# EAGLE board pc_healthypi_5.3 (EAGLE 9.6.2)
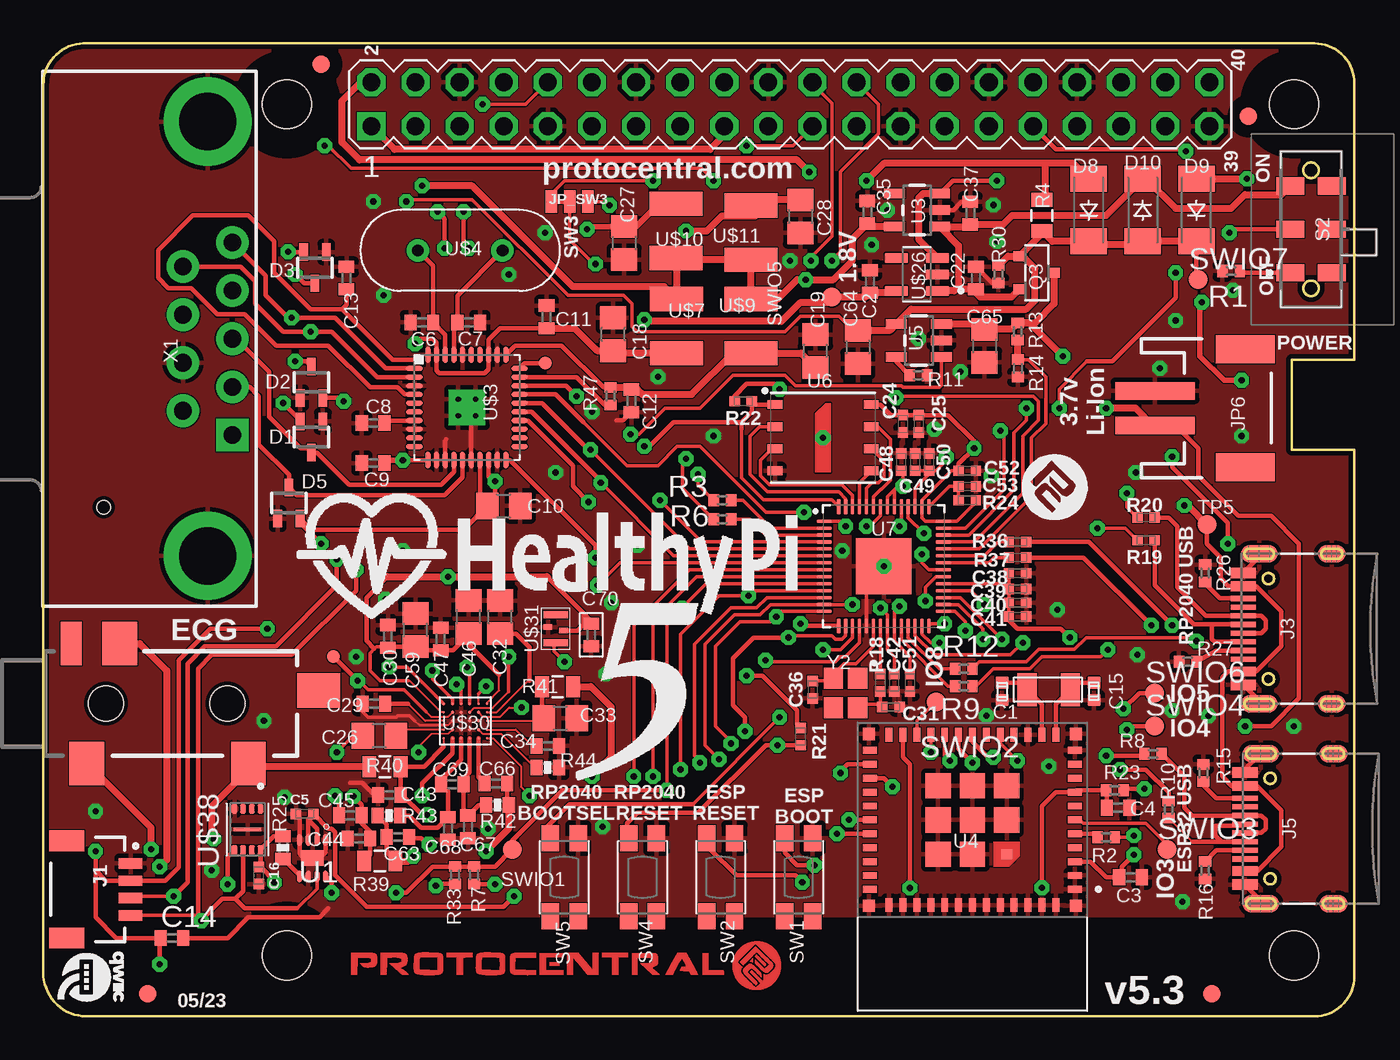
[diagram p3: board, top side]
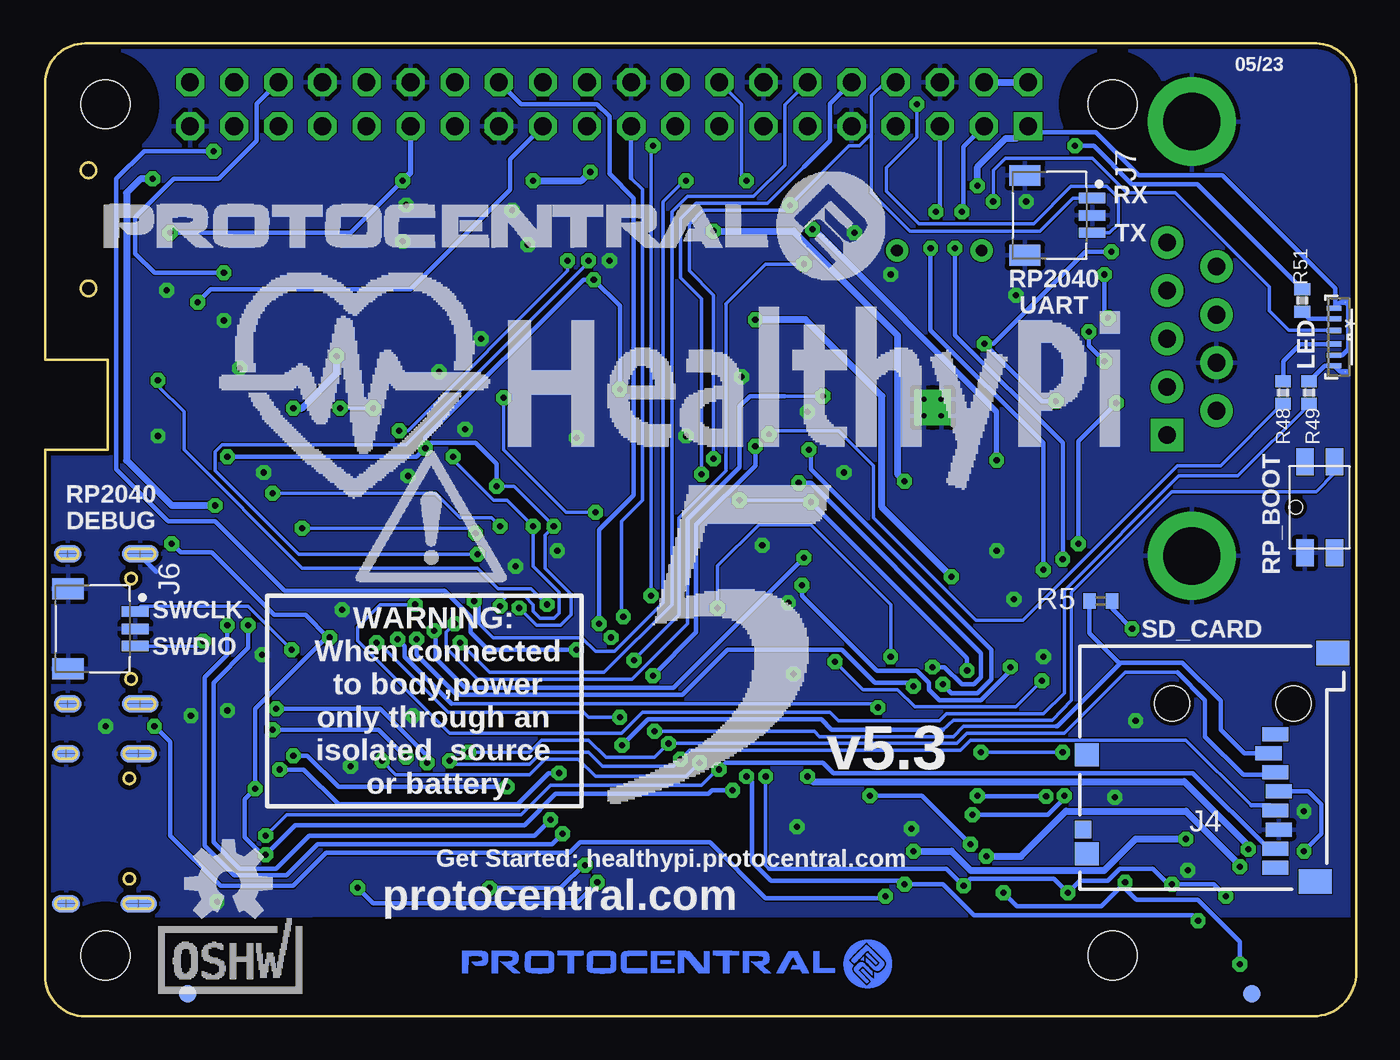
[diagram p4: board, bottom side, seen from below]

Size 75.5 x 56.01 mm. Coordinates in mm from the lower left corner, seen from the top.
Outline: 631 segments
Copper layers (1*16): Top 0.035mm / dielectric 1.5mm / Bottom 0.035mm
Design rules "Circuitects-Rules *": minimum track width 3mil, minimum drill 0.1mm, track to track 0.06858125mm, track to pad 0.06858125mm, pad to pad 0.06858125mm, via to via 6mil, smd to smd 6mil, copper to edge 10mil, drill to drill 4mil, minimum pad ring 12mil, minimum via ring 10mil, stop-mask expansion 4mil, vias tented up to drill 25mil, thermal gap 10mil
Net classes: 1 power: width 0.178 mm; 2 Clock: width 0.089 mm, clearance 0.178 mm; 4 USBpair: width 0.102 mm, drill 0.1 mm, clearance 0.15 mm to class 3
Holes 2.8 mm at 72.02,3.51 72.02,52.51 14.02,52.51 14.02,3.51
Holes 0.9 mm at 73,48.71 73,41.91
Holes 0.65 mm at 70.64,7.92 70.64,13.7 70.55,19.42 70.55,25.2
tRestrict: area 12.5,51 to 15.6,54.1; area 70.5,51 to 73.6,54.1; area 70.5,2 to 73.6,5.1; area 12.5,2 to 15.6,5.1
bRestrict: area 12.5,2 to 15.6,5.1; area 12.5,51 to 15.6,54.1; area 70.5,2 to 73.6,5.1; area 70.5,51 to 73.6,54.1

## Footprints (pad centres in the part's own frame; a part is rotated, then mirrored left to right if it is on the bottom)
C0402 = smd 0.75 x 0.7: 1 0,0.5; 2 0,-0.5
C0402' = smd 0.7 x 0.9: 1 -0.65,0; 2 0.65,0
0402-TIGHT = smd 0.6 x 0.6: 1 -0.5,0; 2 0.5,0
C0805 = smd 1.3 x 1.5: 1 -0.95,0; 2 0.95,0
0402 = smd 0.7 x 0.9: 1 -0.65,0; 2 0.65,0
SOT323 = smd 0.5 x 1: 1 0,0.9; 2 -0.65,-0.9; 3 0.65,-0.9
SOD-123_MINI-SMA = smd 1.5 x 2.1: A 1.8,0; C -1.8,0
JST04_1MM_RA = smd 0.6 x 1.35: 1 -1.5,0; 2 -0.5,0; 3 0.5,0; 4 1.5,0 | smd 1.2 x 2: NC1 2.8,-3.675; NC2 -2.8,-3.675
USB-C-16P = smd 0.3 x 1.45: A5 -1.25,0; A6 -0.25,0; A7 0.25,0; A8 1.25,0; B5 1.75,0; B6 0.75,0; B7 -0.75,0; B8 -1.75,0 | smd 0.6 x 1.45: GND -3.225,0; GND2 3.225,0 | smd 1 x 2.1: SHLD1 -4.32,-0.915; SHLD2 4.32,-0.915 | smd 1 x 2.1 bottom: SHLD3 -4.32,-0.915; SHLD4 4.32,-0.915 | smd 1 x 1.6: SHLD5 -4.32,-5.095; SHLD8 4.32,-5.095 | smd 1 x 1.6 bottom: SHLD6 -4.32,-5.095; SHLD7 4.32,-5.095 | smd 0.55 x 1.45: VBUS1 -2.45,0; VBUS2 2.45,0 | hole 0.65: -2.89,-1.445; 2.89,-1.445
GCT_MEM2051-00-195-00-A = smd 0.8 x 1.5: 1 1.94,-3.66; 2 0.84,-3.26; 3 -0.26,-3.66; 4 -1.36,-3.86; 5 -2.46,-3.66; 6 -3.56,-3.86; 7 -4.66,-3.66; 8 -5.76,-3.66 | smd 1 x 0.95: 9 -3.56,7.425 | smd 1.3 x 1.4: P1 -4.95,7.2; P2 0.75,7.2 | smd 1.4 x 1.9: P3 6.6,-6.95; P4 -6.55,-5.95
JST_SM03B-SRSS-TB(LF)(SN) = smd 0.6 x 1.55: 1 -1,0; 2 0,0; 3 1,0 | smd 1.2 x 1.8: S1 -2.3,-3.875; S2 2.3,-3.875
AUDIO-JACK-3.5MM-SMD = smd 2 x 2.5: RING 4.3,3.45; SLEEVE 2.4,-3.45; TIP 11.7,-3.45 | smd 1.2 x 2.5: RSH 1.5,3.45 | smd 2.5 x 2: TSH 15.75,0.75 | hole 2: 3.5,0; 10.5,0
JST-2-SMD = smd 1 x 4.6: 1 -1,-3.7; 2 1,-3.7 | smd 1.6 x 3.4: NC1 -3.4,1.5; NC2 3.4,1.5
SMT-JUMPER_3_1-NC_TRACE_NO-SILK = smd 0.66 x 1.27: 1 -1.041,0; 2 0,0; 3 1.041,0
PIN_20X2 = drill 1.016 square: 1 -24.13,-1.27 | drill 1.016 octagon: 2 -24.13,1.27; 3 -21.59,-1.27; 4 -21.59,1.27; 5 -19.05,-1.27; 6 -19.05,1.27; 7 -16.51,-1.27; 8 -16.51,1.27; 9 -13.97,-1.27; 10 -13.97,1.27; 11 -11.43,-1.27; 12 -11.43,1.27; 13 -8.89,-1.27; 14 -8.89,1.27; 15 -6.35,-1.27; 16 -6.35,1.27; 17 -3.81,-1.27; 18 -3.81,1.27; 19 -1.27,-1.27; 20 -1.27,1.27; 21 1.27,-1.27; 22 1.27,1.27; 23 3.81,-1.27; 24 3.81,1.27; 25 6.35,-1.27; 26 6.35,1.27; 27 8.89,-1.27; 28 8.89,1.27; 29 11.43,-1.27; 30 11.43,1.27; 31 13.97,-1.27; 32 13.97,1.27; 33 16.51,-1.27; 34 16.51,1.27; 35 19.05,-1.27; 36 19.05,1.27; 37 21.59,-1.27; 38 21.59,1.27; 39 24.13,-1.27; 40 24.13,1.27
LTST-008BGEW_LTO = smd 0.051 x 0.051: 1 2,0.372; 8 -2,0.372 | smd 0.305 x 0.813: 2 1.65,-0.268; 3 1.05,-0.268; 4 0.41,-0.268; 5 -0.38,-0.268; 6 -1.05,-0.268; 7 -1.65,-0.268
SOT23-R = smd 0.6 x 0.7: 1 -0.95,-1; 2 0.95,-1; 3 0,1
R0402 = smd 0.6 x 0.7: 1 -0.5,0; 2 0.5,0
0805 = smd 0.8 x 1.2: 1 -0.9,0; 2 0.9,0
R0402' = smd 0.7 x 0.9: 1 -0.65,0; 2 0.65,0
0402-RES = smd 0.7 x 0.9: 1 -0.65,0; 2 0.65,0
JS202011JAQN = smd 1 x 1.6: 1 -2.5,1.2; 2 0,1.2; 3 2.5,1.2; 4 -2.5,-1.2; 5 0,-1.2; 6 2.5,-1.2 | hole 0.9: -3.4,0; 3.4,0
BTN_KMR2_4.6X2.8 = smd 1.5 x 1: A 2.25,0.8; A' -2.25,0.8; B 2.25,-0.8; B' -2.25,-0.8
TP11R = smd 1.1 x 1.1: TP 0,0
PAD.03X.03 = smd 0.762 x 0.762: P$1 0,0
SON50P200X200X80-9N = smd 0.7 x 0.3: 1 -1.05,0.75; 2 -1.05,0.25; 3 -1.05,-0.25; 4 -1.05,-0.75; 5 1.05,-0.75; 6 1.05,-0.25; 7 1.05,0.25; 8 1.05,0.75 | smd 0.9 x 1.3: 9 0,0
SOT23-5 = smd 0.55 x 1.2: 1 -0.95,-1.3; 2 0,-1.3; 3 0.95,-1.3; 4 0.95,1.3; 5 -0.95,1.3
XCVR_ESP32-C3-MINI-1-N4 = smd 0.8 x 0.4: 1 -5.9,1.3; 2 -5.9,0.5; 3 -5.9,-0.3; 4 -5.9,-1.1; 5 -5.9,-1.9; 6 -5.9,-2.7; 7 -5.9,-3.5; 8 -5.9,-4.3; 9 -5.9,-5.1; 10 -5.9,-5.9; 11 -5.9,-6.7; 25 5.9,-6.7; 26 5.9,-5.9; 27 5.9,-5.1; 28 5.9,-4.3; 29 5.9,-3.5; 30 5.9,-2.7; 31 5.9,-1.9; 32 5.9,-1.1; 33 5.9,-0.3; 34 5.9,0.5; 35 5.9,1.3 | smd 0.4 x 0.8: 12 -4.8,-7.6; 13 -4,-7.6; 14 -3.2,-7.6; 15 -2.4,-7.6; 16 -1.6,-7.6; 17 -0.8,-7.6; 18 0,-7.6; 19 0.8,-7.6; 20 1.6,-7.6; 21 2.4,-7.6; 22 3.2,-7.6; 23 4,-7.6; 24 4.8,-7.6; 36 4.8,2.2; 37 4,2.2; 38 3.2,2.2; 39 2.4,2.2; 40 1.6,2.2; 41 0.8,2.2; 42 0,2.2; 43 -0.8,2.2; 44 -1.6,2.2; 45 -2.4,2.2; 46 -3.2,2.2; 47 -4,2.2; 48 -4.8,2.2 | smd 0.6 x 0.6: 49_1 -1.975,-0.725 | smd 1.45 x 1.45: 49_2 0,-0.725; 49_3 1.975,-0.725; 49_4 1.975,-2.7; 49_5 1.975,-4.675; 49_6 0,-4.675; 49_7 -1.975,-4.675; 49_8 -1.975,-2.7; 49_9 0,-2.7 | smd 0.7 x 0.7: 50 5.95,2.25; 51 5.95,-7.65; 52 -5.95,-7.65; 53 -5.95,2.25
WSON-8-6X5-SKINNY_CENTERPAD = smd 0.85 x 0.5: 1 -2.775,1.905; 2 -2.775,0.635; 3 -2.775,-0.635; 4 -2.775,-1.905; 5 2.775,-1.905; 6 2.775,-0.635; 7 2.775,0.635; 8 2.775,1.905
QFN-56 = smd 0.875 x 0.2: 1 -3.437,2.6; 2 -3.437,2.2; 3 -3.437,1.8; 4 -3.437,1.4; 5 -3.437,1; 6 -3.437,0.6; 7 -3.437,0.2; 8 -3.437,-0.2; 9 -3.437,-0.6; 10 -3.437,-1; 11 -3.437,-1.4; 12 -3.437,-1.8; 13 -3.437,-2.2; 14 -3.437,-2.6; 29 3.437,-2.6; 30 3.437,-2.2; 31 3.437,-1.8; 32 3.437,-1.4; 33 3.437,-1; 34 3.437,-0.6; 35 3.437,-0.2; 36 3.437,0.2; 37 3.437,0.6; 38 3.437,1; 39 3.437,1.4; 40 3.437,1.8; 41 3.437,2.2; 42 3.437,2.6 | smd 0.2 x 0.875: 15 -2.6,-3.437; 16 -2.2,-3.437; 17 -1.8,-3.437; 18 -1.4,-3.437; 19 -1,-3.437; 20 -0.6,-3.437; 21 -0.2,-3.437; 22 0.2,-3.437; 23 0.6,-3.437; 24 1,-3.437; 25 1.4,-3.437; 26 1.8,-3.437; 27 2.2,-3.437; 28 2.6,-3.437; 43 2.6,3.437; 44 2.2,3.437; 45 1.8,3.437; 46 1.4,3.437; 47 1,3.437; 48 0.6,3.437; 49 0.2,3.437; 50 -0.2,3.437; 51 -0.6,3.437; 52 -1,3.437; 53 -1.4,3.437; 54 -1.8,3.437; 55 -2.2,3.437; 56 -2.6,3.437 | smd 3.2 x 3.2: EPAD 0,0
FIDUCIALPOINTS = smd 1 x 1: TP 0,0
QFN-40 = smd 0.95 x 0.28: 1 -3.025,2.25; 2 -3.025,1.75; 3 -3.025,1.25; 4 -3.025,0.75; 5 -3.025,0.25; 6 -3.025,-0.25; 7 -3.025,-0.75; 8 -3.025,-1.25; 9 -3.025,-1.75; 10 -3.025,-2.25; 21 3.025,-2.25; 22 3.025,-1.75; 23 3.025,-1.25; 24 3.025,-0.75; 25 3.025,-0.25; 26 3.025,0.25; 27 3.025,0.75; 28 3.025,1.25; 29 3.025,1.75; 30 3.025,2.25 | smd 0.28 x 0.95: 11 -2.25,-3.025; 12 -1.75,-3.025; 13 -1.25,-3.025; 14 -0.75,-3.025; 15 -0.25,-3.025; 16 0.25,-3.025; 17 0.75,-3.025; 18 1.25,-3.025; 19 1.75,-3.025; 20 2.25,-3.025; 31 2.25,3.025; 32 1.75,3.025; 33 1.25,3.025; 34 0.75,3.025; 35 0.25,3.025; 36 -0.25,3.025; 37 -0.75,3.025; 38 -1.25,3.025; 39 -1.75,3.025; 40 -2.25,3.025 | drill 0.3 pad 1.1 square: EXP@6 -0.5,0.475; EXP@7 0.5,0.475; EXP@10 -0.5,-0.475; EXP@11 0.5,-0.475
XTAL_HC49P488W43L1150T466H350 = drill 0.68 pad 1.08: 1 -2.44,0; 2 2.44,0
LPS = smd 1.4 x 3.05: 1 -1.56,0; 2 1.56,0
ECX-31B = smd 1.1 x 1.9: P$1 1.25,0; P$2 -1.25,0
EVQ-PUC = smd 1.55 x 1: 1 2.625,0.85; 2 2.625,-0.85; 3 -2.625,0.85; 4 -2.625,-0.85 | hole 0.75: 0,1.375
SOT95P285X140-5N = smd 1.35 x 0.6: 1 -1.185,0.95; 2 -1.185,0; 3 -1.185,-0.95; 4 1.185,-0.95; 5 1.185,0.95
30WLP = smd 0.15 x 0.15: A1 -1.25,1; A2 -0.75,1; A3 -0.25,1; A4 0.25,1; A5 0.75,1; A6 1.25,1; B1 -1.25,0.5; B6 1.25,0.5; C1 -1.25,0; C6 1.25,0; D1 -1.25,-0.5; D6 1.25,-0.5; E1 -1.25,-1; E2 -0.75,-1; E3 -0.25,-1; E4 0.25,-1; E5 0.75,-1; E6 1.25,-1 | smd 0.2 x 0.2: B2 -0.75,0.5; B3 -0.25,0.5; B4 0.25,0.5; B5 0.75,0.5; C2 -0.75,0; C3 -0.25,0; C4 0.25,0; C5 0.75,0; D2 -0.75,-0.5; D3 -0.25,-0.5; D4 0.25,-0.5; D5 0.75,-0.5
SIT1533 = smd 0.4 x 1.4: 1 -0.8,0; 3 0.8,0 | smd 0.3 x 0.5: 2 -0.1,-0.45; 4 0.1,0.45
PSON50P200X300X60-9N = smd 0.56 x 0.35: 1 -1.185,0.75; 2 -1.185,0.25; 3 -1.185,-0.25; 4 -1.185,-0.75; 5 1.185,-0.75; 6 1.185,-0.25; 7 1.185,0.25; 8 1.185,0.75 | smd 0.2 x 1.6: 9 0,0
DB9 = drill 1.016 pad 1.88 square: 1 -5.54,-1.42 | drill 1.016 pad 1.88: 2 -2.77,-1.42; 3 0,-1.42; 4 2.77,-1.42; 5 5.54,-1.42; 6 -4.15,1.42; 7 -1.38,1.42; 8 1.38,1.42; 9 4.15,1.42 | drill 3.302 pad 5.08: G1 -12.5,0; G2 12.5,0
CRYSTAL-SMD-2X2.5MM = smd 1.2 x 1.1: P1 0.846,0.69; P2 -0.854,0.69; P3 -0.854,-0.71; P4 0.846,-0.71

## Placement (x,y rotation side)
C1  12pF  [C0402]  55.2,18.71 0 top
C2  100nF  [C0402']  47.6,42.31 90 top
C3  1u  [C0402']  62.6,8.01 180 top
C4  1u  [C0402']  61.9,12.01 180 top
C5  0.1uF  [0402-TIGHT]  15.05,11.66 180 top
C6  22p  [C0402']  21.79,39.95 0 top
C7  22p  [C0402']  24.49,39.95 180 top
C8  2.2u  [C0402']  18.99,34.15 180 top
C9  0.1u  [C0402']  18.99,31.85 180 top
C10  1u  [C0805]  26.51,29.38 0 top
C11  0.1u  [C0402']  28.97,40.27 90 top
C12  0.1u  [C0402']  33.86,35.43 270 top
C13  2.2u  [C0402']  17.46,42.5 90 top
C14  100nF  [C0402']  7.4,4.51 0 top
C15  12pF  [C0402]  60.5,18.71 180 top
C16  0.1uF  [0402-TIGHT]  12.4,8.11 270 top
C18  10uF/0805  [C0805]  32.81,39.27 90 top
C19  10uF/0805  [C0805]  44.46,38.3 90 top
C22  100nF  [C0402']  53.7,42.51 90 top
C24  0.1uF  [0402-TIGHT]  49.5,34.11 270 top
C25  2.2uF  [0402-TIGHT]  50.4,34.11 270 top
C26  10uF/25V  [C0805]  19.34,16.15 180 top
C27  10uF/0805  [C0805]  33.44,44.52 270 top
C28  10uF/0805  [C0805]  43.59,46.05 270 top
C29  1nF  [C0402']  19.03,18 180 top
C30  1uF  [C0402']  19.84,21.88 90 top
C31  15pF  [0402-TIGHT]  48.8,17.81 180 top
C32  10uF  [C0805]  26.31,22.99 90 top
C33  10uF  [C0805]  29.76,17.17 0 top
C34  1uF  [C0402']  29.05,15.57 0 top
C35  1u  [C0402']  47.45,46.29 270 top
C36  15pF  [0402-TIGHT]  44.3,18.81 90 top
C37  1u  [C0402']  53.38,46.24 270 top
C38  0.1uF  [0402-TIGHT]  56.1,25.51 0 top
C39  0.1uF  [0402-TIGHT]  56.1,24.61 0 top
C40  0.1uF  [0402-TIGHT]  56.1,23.81 0 top
C41  0.1uF  [0402-TIGHT]  56.1,23.01 0 top
C42  0.1uF  [0402-TIGHT]  49,19.21 270 top
C43  10pF  [C0402']  19.92,12.74 180 top
C44  10pF  [C0402']  18.17,10.24 180 top
C45  DNP  [C0402']  17.68,11.58 180 top
C46  10uF  [C0805]  24.48,23 90 top
C47  1uF  [C0402']  22.88,21.72 90 top
C48  0.1uF  [0402-TIGHT]  49.4,31.91 90 top
C49  0.1uF  [0402-TIGHT]  50.2,31.91 90 top
C50  0.1uF  [0402-TIGHT]  51,31.91 90 top
C51  2.2uF  [0402-TIGHT]  49.9,19.21 270 top
C52  2.2uF  [0402-TIGHT]  53.2,31.41 0 top
C53  2.2uF  [0402-TIGHT]  53.2,30.51 0 top
C59  10uF  [C0805]  21.43,22.24 90 top
C63  47nF  [C0402']  20.41,10.33 0 top
C64  4.7u  [C0805]  46.9,38.52 270 top
C65  4.7u  [C0805]  54.2,38.59 270 top
C66  47nF  [C0402']  26.05,13.41 180 top
C67  DNP  [C0402']  24.45,10.91 270 top
C68  DNP  [C0402']  23.3,10.81 270 top
C69  DNP  [C0402']  23.55,13.36 180 top
C70  1uF  [0402]  31.55,21.96 270 top
D1  BAV99W-7-F  [SOT323]  15.44,33.35 180 top
D2  BAV99W-7-F  [SOT323]  15.44,36.5 0 top
D3  BAV99W-7-F  [SOT323]  15.64,43.1 180 top
D5  BAV99W-7-F  [SOT323]  14.14,29.55 0 top
D8  DNP  [SOD-123_MINI-SMA]  60.2,46.41 90 top
D9  S1B-13-F  [SOD-123_MINI-SMA]  66.4,46.41 90 top
D10  S1B-13-F  [SOD-123_MINI-SMA]  63.3,46.41 270 top
J1  10147606-00004LF  [JST04_1MM_RA]  5.02,7.31 270 top
J3  USB4105-GF-A  [USB-C-16P]  69.1,22.31 90 top
J4  MEM2051-00-195-00-A  [GCT_MEM2051-00-195-00-A]  8.3,14.31 90 bottom
J5  USB4105-GF-A  [USB-C-16P]  69.2,10.81 90 top
J6  SM03B-SRSS-TB(LF)(SN)  [JST_SM03B-SRSS-TB(LF)(SN)]  70.3,22.31 270 bottom
J7  SM03B-SRSS-TB(LF)(SN)  [JST_SM03B-SRSS-TB(LF)(SN)]  15.2,46.11 270 bottom
JP3  35RASMT4BHNTRX  [AUDIO-JACK-3.5MM-SMD]  0.1,18.01 0 top
JP6  S2B-PH-SM4-TB(LF) (SN)  [JST-2-SMD]  67.72,35.01 270 top
JP_SW3  JUMPER-SMT_3_1-NC_TRACE_NO-SILK  [SMT-JUMPER_3_1-NC_TRACE_NO-SILK]  30.3,46.91 180 top
K1  PIN20X2 (2223)  [PIN_20X2]  43.02,52.51 0 top
LED1  LTST-006GEBW-P2  [LTST-008BGEW_LTO]  1,39.11 270 bottom
Q3  SI2323DS-TI-GE3  [SOT23-R]  57.2,42.81 270 top
R1  DNP  [R0402]  68.4,42.91 0 top
R2  0R  [R0402]  61.2,10.31 180 top
R3  100R  [R0402]  39.1,29.71 180 top
R4  0R  [0805]  57.5,46.11 270 top
R5  10K  [R0402']  14.7,23.91 0 bottom
R6  100R  [R0402]  39.1,28.61 180 top
R7  10K  [R0402]  24.8,8.12 270 top
R8  22R  [R0402]  63.9,15.11 180 top
R9  100R  [R0402]  53,19.01 180 top
R10  22R  [R0402]  64.8,11.91 90 top
R11  1k  [R0402]  50.38,36.91 180 top
R12  100R  [R0402]  53,20.01 180 top
R13  10K  [R0402]  56.1,39.42 90 top
R14  10K  [R0402]  56.12,37.31 90 top
R15  5.1K  [R0402]  66.8,14.01 90 top
R16  5.1K  [R0402]  66.9,8.41 270 top
R18  1k  [0402-TIGHT]  48.2,19.21 90 top
R19  27  [0402-TIGHT]  63.5,27.41 180 top
R20  27  [0402-TIGHT]  63.5,28.71 180 top
R21  1k  [0402-TIGHT]  43.6,16.11 270 top
R22  10k  [0402-TIGHT]  40.3,35.41 180 top
R23  0R  [R0402]  61.7,13.01 0 top
R24  200OHM-0402T-1/16W-1%  [0402-TIGHT]  53.2,29.71 0 top
R25  10K  [0402-RES]  13.8,9.71 90 top
R26  5.1K  [R0402]  66.9,25.51 90 top
R27  5.1K  [R0402]  65.9,20.41 180 top
R30  10K  [R0402]  55,42.71 90 top
R33  10K  [R0402]  23.7,8.12 270 top
R36  DNP  [0402-TIGHT]  56.1,27.31 0 top
R37  DNP  [0402-TIGHT]  56.1,26.41 0 top
R39  200K  [0805]  19.37,8.94 180 top
R40  200K  [0805]  19.67,14.38 0 top
R41  0R  [0805]  29.61,18.98 0 top
R42  0R  [0402-RES]  26.15,12.16 180 top
R43  0R  [0402-RES]  19.9,11.56 0 top
R44  DNP  [0402-RES]  29.04,14.33 0 top
R47  10K  [R0402]  32.66,35.7 270 top
R48  330R  [0402-RES]  4.2,35.91 90 bottom
R49  330R  [0402-RES]  2.7,35.91 90 bottom
R51  330R  [0402-RES]  3.1,41.21 90 bottom
S2  JS202011JAQN  [JS202011JAQN]  73,45.31 90 top
SW1  KMR211GLFS  [BTN_KMR2_4.6X2.8]  43.5,8.01 270 top
SW2  KMR211GLFS  [BTN_KMR2_4.6X2.8]  39,8.01 270 top
SW4  KMR211GLFS  [BTN_KMR2_4.6X2.8]  34.5,8.01 270 top
SW5  KMR211GLFS  [BTN_KMR2_4.6X2.8]  30,8.01 270 top
SWIO1  TPSQTP11R  [TP11R]  27,9.61 0 top
SWIO2  TPSQTP11R  [TP11R]  51.4,18.11 0 top
SWIO3  TPSQTP11R  [TP11R]  64.7,9.61 0 top
SWIO4  TPSQTP11R  [TP11R]  64,16.71 0 top
SWIO5  TPSQTP11R  [TP11R]  45.4,41.41 180 top
SWIO6  TPSQTP11R  [TP11R]  64,18.61 0 top
SWIO7  TPSQTP11R  [TP11R]  66.5,42.41 0 top
TP2  TEST-POINT3  [PAD.03X.03]  16.7,20.71 0 top
TP4  TEST-POINT3  [PAD.03X.03]  28.89,37.6 0 top
TP5  TPSQTP11R  [TP11R]  67,28.31 0 top
U1  MAX17048G+TDFN-08  [SON50P200X200X80-9N]  15.5,9.11 270 top
U3  TCR2EF33,LM(CT  [SOT23-5]  50.32,46.41 90 top
U4  ESP32-C3-MINI-1-N4  [XCVR_ESP32-C3-MINI-1-N4]  53.5,8.61 180 top
U5  MCP73831T-2ATI/OT  [SOT23-5]  50.42,38.91 90 top
U6  W25Q128JVPIQ  [WSON-8-6X5-SKINNY_CENTERPAD]  44.9,33.31 0 top
U7  RP2040TR13  [QFN-56]  48.4,25.91 0 top
U$1  FUDCIALPOINTS  [FIDUCIALPOINTS]  16,54.81 0 top
U$2  [HEALTHYPI_5_ONLY]  30.7,13.61 0 top
U$3  AFE4400RHAR  [QFN-40]  24.39,35.05 0 top
U$4  HC-49/U-S16000000ABJB  [XTAL_HC49P488W43L1150T466H350]  24,44.09 180 top
U$5  OSHW-LOGOM  [OSHW-LOGO-M]  64.94,7.64 0 bottom
U$7  MAKK2520H100M  [LPS]  36.46,39.73 270 top
U$9  MAKK2520H100M  [LPS]  40.76,39.73 270 top
U$10  MAKK2520H100M  [LPS]  36.44,45.21 90 top
U$11  MAKK2520H100M  [LPS]  40.74,45.11 90 top
U$13  [CERT-SMALL-SILK]  64.84,1.31 0 bottom
U$17  [WARNINGSYM]  57.7,24.91 0 bottom
U$18  [HEALTHYPIFIT]  14.6,18.21 0 top
U$19  520-327-12.5-34B(32.768KHZ)  [ECX-31B]  57.9,18.81 180 top
U$20  [HEALTHYPIV5LOGO]  65.4,12.31 0 bottom
U$21  FUDCIALPOINTS  [FIDUCIALPOINTS]  67.3,1.31 0 top
U$22  [PC_LOGO_ONELINE_ROUND]  17.6,1.41 0 top
U$23  FUDCIALPOINTS  [FIDUCIALPOINTS]  6,1.31 0 top
U$24  EVQ-PUC  [EVQ-PUC]  2.1,29.31 90 bottom
U$25  FUDCIALPOINTS  [FIDUCIALPOINTS]  67.3,1.31 0 bottom
U$26  TCR2EF18,LM(CT  [SOT95P285X140-5N]  50.3,42.71 180 top
U$27  [PC_LOGO_ONELINE_ROUND]  51.6,1.51 0 bottom
U$28  FUDCIALPOINTS  [FIDUCIALPOINTS]  69.4,51.81 0 top
U$29  FUDCIALPOINTS  [FIDUCIALPOINTS]  6,1.31 0 bottom
U$30  MAX30001CWV+  [30WLP]  24.3,17.01 180 top
U$31  SIT1533AI-H4-DCC-32.768E  [SIT1533]  29.5,22.31 270 top
U$35  [PCROUNDLOGO]  52.7,26.41 0 top
U$36  [PCLOGOV3]  72.1,42.41 0 bottom
U$38  ATECC608A-MAHDA-T  [PSON50P200X300X60-9N]  11.75,10.76 270 top
U$59  [QWIIC#LABEL#FULL#M#PNG]  2.73,2.34 270 top
X1  A-DF09A/KG-T2S  [DB9]  9.46,39.01 90 top
Y2  NX3225SA-12MHZ-STD-CSR-3  [CRYSTAL-SMD-2X2.5MM]  46.2,18.61 270 top

## Tracks (layer width: path | path; a pad name or v marks a point on that pad's centre or on a via)
1.1V  (via drill 0.35)
  Top 0.2: U7.45 50.2,30.41 51,31.21 C50.1 | C49.1 C50.1 | C51.1 49.9,20.71 49,21.61 U7.23 49,23.31 v49.3,23.61 | v47.4,28.21 47.6,28.21 48.2,28.81 U7.50 | C50.1 51.4,31.41 52,32.01 v52,32.21
  Bottom 0.2: v49.3,23.61 49.3,23.81 48.9,24.21 47.9,24.21 47.4,23.71 47.4,23.31 47,22.91 46.2,22.91 45.9,23.21 45.9,24.41 47.4,25.91 v47.4,28.21 48.9,29.71 49.66,29.71 52,32.04 v52,32.21
!ADC_RESET
  Top 0.254: R47.2 32.31,35.2 30.71,36.8 U$3.29
!RESET!  (via drill 0.35)
  Top 0.2: U7.26 50.2,21.91 51.3,20.81 55.7,20.81 v56.4,21.51 | v42.4,17.21 37.4,12.21
  Top 0.254: 37.4,12.21 30.3,12.21 29,10.91 SW5.B'
  Bottom 0.2: v56.4,21.51 56.3,21.51 52.3,17.51 44.5,17.51 44.2,17.21 v42.4,17.21
+1.8V  (via drill 0.35)
  Top 0.127: U$30.D6 22.9,17.51 21.1,19.31 21,19.31 | U$30.E1 25.55,18.06 26.25,18.76 26.25,19.66
  Top 0.2: 19.9,21.29 19.18,21.29 19.05,21.16 18.8,20.91 18.8,19.91 19.4,19.31 21,19.31
  Top 0.254: C30.1 19.9,21.29 C59.1 21.65,21.07 C47.1 23.6,21.07 24.48,21.95 C46.1 24.48,21.43 26.25,19.66 | U$31.4 30.75,22.21 31.1,22.56 31.1,23.21 | C70.1 31.55,22.76 31.1,23.21 | 19.8,25.31 18.6,24.11 18.6,21.61 19.05,21.16 | 31.1,23.21 29.05,25.26
  Top 0.406: 19.8,25.31 v23.3,25.31 29,25.31 29.05,25.26 | U$26.5 49.02,41.66 C2.1 47.35,41.41 SWIO5.TP 45.1,41.11 43.6,41.11 42.5,40.01 34.7,40.01 v34.6,40.11
  Bottom 0.406: v23.3,25.31 27.3,29.31 27.3,35.71 31.7,40.11 v34.6,40.11
+3V3  (via drill 0.35, 0.35 pad 0.55)
  Top 0.127: U$30.D3 24.8,17.76 25.88,17.76 26.8,18.68
  Top 0.2: 26.8,18.68 v26.8,20.71 | C38.1 C39.1 | C41.1 C40.1 C39.1 | R24.2 53.7,29.61 52.6,28.51 U7.42 50.8,28.51 50.6,28.71 U7.44 50.6,29.71 52.3,31.41 C52.1 | U7.49 48.6,29.91 49,30.31 | C42.1 49,20.71 48.6,21.11 U7.22 48.6,23.11 v48.2,23.51 | U7.10 38.16,24.91 36.78,23.53 v36.78,23.51 35.9,22.63 v35.9,13.01 | v46.2,28.21 45.9,28.51 U7.1 | C48.1 49.5,31.31 v49.5,30.51 49.2,30.51 49,30.31 | U7.48 49,30.31 | C39.1 55.3,24.91 U7.33
  Top 0.254: U4.3 60.3,8.91 61.2,8.01 C3.2 | 61.95,8.16 C3.2 | R23.2 62.3,13.11 v63.4,13.11 | v59.1,21.81 58.6,22.31 56.1,22.31 55.6,22.81 C41.1 | U6.8 48.2,35.21 48.8,34.61 C24.1 C25.1 52.1,34.61 53.6,33.11 v53.6,32.71 52.7,31.81 C52.1 | v35.9,13.01 29.9,13.01 27,10.11 SWIO1.TP 26.02,8.62 R7.1 R33.1 22.42,8.62 20.9,7.11 v20.3,7.11 | R22.2 39.8,35.71 40.5,36.41 42.1,36.41 v42.4,36.11 | C3.2 61.95,8.11 62.1,8.26 62.1,8.61 v62.8,9.31 | v68.2,27.21 68.2,28.41 65,31.61 v65,32.21 | 3,8.41 3,5.71 4.2,4.51 C14.1 6.7,4.46 v6.7,3.01 | 3,8.41 v3,9.51 | v12.9,22.31 9.6,22.31 7.8,20.51 7.8,8.59 7.02,7.81 J1.2 3.6,7.81 3,8.41 | R25.2 13.25,10.36 12.5,9.61 U$38.8 12.5,8.71 C16.1 12.5,8.61 13.3,7.81 v13.3,7.71
  Top 0.406: U3.5 47.63,45.46 C35.2 46.55,44.74 46.55,43.46 45.5,42.41 v43.9,42.41 43.4,42.41 42.29,41.29 U$9.1 40.74,41.31 U$11.1 36.54,43.55 U$10.1 36.46,43.63 U$7.1 35.75,42.01 30.5,42.01 24.7,47.81 v21.8,47.81 | K1.17 39.21,50.71 38.4,49.91 20.22,49.91 K1.1
  Bottom 0.2: v36.78,23.51 36.78,25.93 34.4,28.31 31.4,28.31 26.8,23.71 v26.8,20.71 | v48.2,23.51 47.2,22.51 45.8,22.51 45.2,23.11 45.2,24.31 46.7,25.81 46.7,27.71 v46.2,28.21 48.5,30.51 v49.5,30.51
  Bottom 0.254: v59.1,21.81 59.2,21.81 | 59.2,21.81 59.3,21.81 63.4,17.71 v63.4,13.11 64,12.51 64,10.31 63,9.31 v62.8,9.31 61.1,11.01 47.9,11.01 46.1,12.81 37.3,12.81 37.1,13.01 v35.9,13.01 | v68.2,27.21 67.7,26.71 65.9,26.71 62.3,23.11 60.5,23.11 59.2,21.81 | v53.6,32.71 53.3,33.01 50.7,33.01 49.5,31.81 v49.5,30.51 | v53.6,32.71 53.6,33.31 44.5,42.41 v43.9,42.41 42.4,40.91 v42.4,36.11 | v65,32.21 54.1,32.21 v53.6,32.71 | 1.21,40.82 0.92,41.11 LED1.8 0.46,40.94 0.46,38.41 0.81,38.06 LED1.3 | 1.21,40.82 LED1.7 | 1.21,40.82 1.21,41.92 7.7,48.41 12.5,48.41 15,50.91 18.56,50.91 K1.1 | J4.4 2.74,12.95 2,12.21 2,10.51 v3,9.51 | R5.2 14.05,23.46 v12.9,22.31 | v6.7,3.01 6.7,4.31 9.1,6.71 12.65,6.71 13.3,7.35 v13.3,7.71 14.67,6.33 19.53,6.33 v20.3,7.11
  Bottom 0.406: v21.8,47.81 21.8,48.91 20.17,50.54 19.59,50.54 K1.1
+5V  (via drill 0.35)
  Top 0.406: D8.A 59.3,49.11 57.7,49.11 | 57.7,49.11 48.4,49.11 v47.4,48.11 | v44.1,48.61 43.4,49.31 18.2,49.31 17.2,50.31 17.2,52.71 18.27,53.78 K1.2 | 57.7,49.11 57.7,47.21 R4.1
  Bottom 0.406: K1.4 K1.2 | v47.4,48.11 44.6,48.11 v44.1,48.61
ALRT
  Top 0.254: U1.5 14.75,8.11 R25.1
AVDD
  Top 0.2: U7.43 52.16,30.51 C53.1 R24.1
BAT_MON
  Top 0.2: R14.2 56.72,37.81 57.72,36.81 57.72,34.12 56.9,33.31 56.9,29.91 53.9,26.91 U7.38
  Top 0.406: R13.1 56.1,37.82 R14.2
BOOT  (via drill 0.35)
  Top 0.254: R21.2 v42.28,15.61 41.6,15.61 37.7,11.71 34.2,11.71 33.6,11.11 SW4.B'
  Bottom 0.2: 23.8,16.51 23.2,17.06 17.5,17.06 16.4,18.21 16.4,24.41 10.6,30.21 2.3,30.21 1.25,31.26 U$24.2
  Bottom 0.254: v42.28,15.61 40.77,17.12 38.51,17.12 38.5,17.11 30.8,17.11 30.2,16.51 23.8,16.51
CHR_STUS  (via drill 0.35)
  Top 0.2: U5.1 51.72,36.32 51.6,36.21 49.5,36.21 49.4,36.31 43.3,36.31 42.7,36.91 39.7,36.91 37.8,35.01 35.8,35.01 34.3,33.51 v33.8,33.51
  Bottom 0.2: v33.8,33.51 33.7,33.51 33.5,33.71 29.8,33.71 27.8,31.71 27.8,28.71 21.9,22.81 19.2,22.81 10.3,31.71 7.8,31.71 4.25,35.26 R48.1
ECG_CS  (via drill 0.35)
  Top 0.2: U$30.E6 20.95,20.11 v19.9,20.11 | U7.7 33.2,26.11 v31.9,24.81
  Bottom 0.254: v19.9,20.11 19.9,19.91 21.6,18.21 24,18.21 24.6,18.81 24.6,19.21 25.3,19.91 27.6,19.91 31.9,24.21 v31.9,24.81
ECG_VCM
  Top 0.127: U$30.C1 28.65,17.01
  Top 0.254: 28.65,17.01 C33.1 28.71,17.27 R41.1
ECGN  (via drill 0.35)
  Top 0.127: U$30.A6 23.05,15.51
  Top 0.254: 23.05,15.51 21.92,14.38 R40.2 C43.1 20.67,12.74 21.8,11.61 v22.1,11.61 | v16.8,12.71 17.03,12.48 C45.2
  Bottom 0.254: v22.1,11.61 17.75,11.61 16.8,12.56 v16.8,12.71
ECGN1  (via drill 0.35)
  Top 0.254: R42.1 26.7,12.26 C66.1
  Top 0.406: R40.1 12.43,14.38 JP3.TIP 11.8,14.21 9.7,12.11 9.7,10.31 v9.8,10.21 | R42.1 26.8,10.81 v25.5,9.51
  Bottom 0.406: v25.5,9.51 23.3,9.51 22.2,8.41 14.5,8.41 12.7,10.21 v9.8,10.21
ECGP  (via drill 0.35)
  Top 0.254: U$30.A5 23.55,15.16 21.8,13.41 v21.8,12.71 | v17.85,12.66 18.33,12.18 C45.1 18.33,11.13 18.82,10.64 C44.1 18.82,9.29 R39.2
  Bottom 0.254: v21.8,12.71 21.75,12.66 v17.85,12.66
ECGP1  (via drill 0.35)
  Top 0.254: R39.1 19.76,9.45 C63.1 19.76,11.05 R43.1
  Top 0.406: R39.1 21.03,8.94 v21.3,9.21 | v6.7,8.61 7.1,9.01 7.1,19.91 5.55,21.46 JP3.RING
  Bottom 0.406: v21.3,9.21 19.3,9.21 16.7,11.81 9.8,11.81 6.7,8.71 v6.7,8.61
EN  (via drill 0.35)
  Top 0.254: U3.3 52.37,48.11 v54.9,48.11 | v68.3,45.11 68.5,45.31 S2.2
  Top 0.406: U3.3 50.65,47.36 50.4,47.11 50.4,44.74 U$26.3
  Bottom 0.254: v68.3,45.11 57.9,45.11 v54.9,48.11
  Bottom 0.305: K1.29 54.45,48.56 v54.9,48.11
ESP32_CS  (via drill 0.35)
  Top 0.2: U7.12 41.66,24.11 41.06,23.51 39.6,23.51 37.5,21.41 37.5,15.01 37.8,14.71 v37.8,14.61 | v56.1,14.71 55.1,15.71 U4.16
  Bottom 0.2: v37.8,14.61 38.6,13.81 43.8,13.81 44.8,14.81 46.7,14.81 47.6,13.91 55.3,13.91 v56.1,14.71
ESP32_MISO
  Top 0.254: U4.5 60.5,10.51 R2.2
ESP32_SD_TFT_MISO  (via drill 0.35)
  Top 0.2: v40.5,50.11 43.16,50.11 K1.21 | U7.11 40.9,24.51 v40.6,24.21 38.9,24.21 36.7,22.01 v36.7,14.21 | v62.8,10.41 62.7,10.31 R2.1
  Bottom 0.2: v40.5,50.11 40.6,50.01 v40.6,24.21 | v62.8,10.41 61.6,11.61 48.1,11.61 46.4,13.31 37.7,13.31 36.8,14.21 v36.7,14.21 36.4,14.51
  Bottom 0.254: J4.7 5.04,9.65 9.4,14.01 30.1,14.01 30.7,14.61 36.3,14.61 36.4,14.51
ESP32_SD_TFT_MOSI  (via drill 0.35)
  Top 0.2: v42.2,23.01 42.5,23.31 U7.14 42.46,23.31 41.86,22.71 40.1,22.71 38.7,21.31 38.7,16.71 39.6,15.81 v39.6,15.71 | U4.21 v51.1,15.21
  Bottom 0.2: v42.2,23.01 42.3,23.11 42.3,28.51 41.1,29.71 41.1,47.61 41.75,48.26 | v51.1,15.21 47.6,15.21 46.9,15.91 44.2,15.91 43.2,14.91 40.4,14.91 v39.6,15.71 23,15.71 22.4,16.31 16.8,16.31 13.3,19.81 10.3,19.81
  Bottom 0.254: 41.75,48.26 K1.19 | J4.3 4.78,13.91 6.5,13.91 8.7,16.11 8.7,18.21 10.3,19.81
ESP32_SD_TFT_SCK  (via drill 0.35)
  Top 0.2: v52.2,14.71 51.9,15.01 U4.20 | v38.9,14.81 38.1,15.61 38.1,21.41 39.8,23.11 41.26,23.11 41.86,23.71 U7.13 v46.6,23.71
  Top 0.305: v69,36.61 68,36.61 66.6,38.01 66.6,41.01 v66.7,41.11
  Bottom 0.2: v69,36.61 69,36.31 67.5,34.81 67.5,32.61 60.7,25.81 50.6,25.81 49.4,24.61 47.5,24.61 v46.6,23.71 | v52.2,14.71 52,14.51 47.6,14.51 46.9,15.21 44.2,15.21 43.4,14.41 39.3,14.41 v38.9,14.81 38.4,15.31 22.8,15.31 22.2,15.91 9.8,15.91 6.03,12.14
  Bottom 0.254: K1.23 48.73,49.34 48.73,47.58 54.45,41.86 65.95,41.86 v66.7,41.11 | J4.5 4.93,12.14 6.03,12.14
ESP32_UART_RXD  (via drill 0.35)
  Top 0.254: R37.2 59.9,26.41 v63.8,22.51 | U4.30 v46.4,11.31
  Bottom 0.254: v63.8,22.51 63.8,21.21 65.8,19.21 65.8,10.01 64.3,8.51 62.2,8.51 60.3,10.41 47.3,10.41 v46.4,11.31
ESP32_UART_TXD  (via drill 0.35)
  Top 0.254: R36.2 60.2,27.31 v65,22.51 | U4.31 v45.7,10.51
  Bottom 0.254: v65,22.51 65,20.81 66.3,19.51 66.3,9.81 64.6,8.11 61.6,8.11 59.8,9.91 46.3,9.91 v45.7,10.51
ESP_BOOT  (via drill 0.35)
  Top 0.254: U4.23 49.5,14.91 49.9,14.51 v49.9,7.39 | v44.4,8.71 43.4,8.71 42.7,9.41 SW1.B'
  Bottom 0.254: v49.9,7.39 45.8,7.39 44.44,8.75 v44.4,8.71
ESP_RST  (via drill 0.35)
  Top 0.254: C4.2 61.25,12.96 R23.1 59.5,13.01 U4.8 58.3,12.91 57.5,12.11 v57.5,7.4 | v43.7,7.71 43.3,8.11 39.9,8.11 38.4,9.61 SW2.B'
  Bottom 0.254: v57.5,7.4 56.61,6.51 44.9,6.51 v43.7,7.71
FCLK  (via drill 0.35)
  Top 0.127: 22.04,17.54 22.32,17.26 23.3,17.26 U$30.D5
  Top 0.2: 22.04,17.54 20.77,18.81 18.7,18.81 18.2,19.31 v18.1,19.31 | v30,20.41 29.4,21.01 29.4,21.41 U$31.3
  Top 0.254: v18.1,19.31 TP2.P$1
  Bottom 0.2: v18.1,19.31 19.6,17.81 25.4,17.81 26.4,18.81 28.4,18.81 v30,20.41
GND  (via drill 0.35, 0.35 pad 0.55, 0.35 pad 0.65)
  Top 0.127: U$30.C5 23.3,16.76 21.65,16.76 21.38,17.03
  Top 0.2: 21.38,17.03 21.1,17.31 20.4,17.31 20.3,17.21 18.7,17.21 18.38,17.53 C29.2 | U7.19 47.4,24.91 U7.EPAD
  Top 0.254: U$3.16 24.64,34.33 U$3.EXP@11 | U$3.13 23.14,33.15 23.2,33.21 | J3.GND 70.02,18.17 J3.SHLD3 | J5.GND 70.11,6.67 J5.SHLD1 | J5.GND2 69.2,14.21 J5.SHLD2 | U3.2 52.4,46.41 52.88,46.89 C37.1 | C22.2 54.65,42.21 R30.1 | J3.GND2 70.02,26.45 J3.SHLD2 | C12.2 33.38,34.31 33,34.31 | C43.2 19.07,12.74 18.35,13.46 17.65,13.46 | 16.4,6.21 15.9,5.71 11.8,5.71 10.6,4.51 C14.2 | C5.2 14.75,11.46 U1.4 14.75,9.36 15,9.11 U1.9 15.9,9.11 16.25,9.46 U1.1
  Bottom 0.254: J3.SHLD2 70.02,26.52 69.1,25.61
  other vias: 9.7,8.41 13.9,12.61 19.7,24.01 32.7,23.81 69,33.41 20.7,26.81 19.6,41.51 32.2,10.91 54.9,44.61 47.7,44.41 51.3,33.81 48.4,25.91 50.4,39.01 44.9,33.31 54.7,46.71 34.2,27.11 29.5,31.31 52.8,37.11 54.6,31.11 46,26.81 62.9,31.31 38.6,33.41 64.3,37.31 43,43.51 25.6,10.81 65,17.61 67.1,17.31 72,16.71 65.2,40.06 65.6,6.61 63,20.81 68.5,41.81 35.4,36.81 31.6,34.81 57.9,14.41 12.7,17.01 32.4,19.71 18,20.71 19,46.91 3,11.81 28.9,45.11 26.8,42.71 54.3,17.31 58.4,23.41 48.6,46.41
  pour Bottom: 0,5.81 75.22,5.81 arc90 75.52,6.11 75.52,54.01 arc90 73.52,56.01 2.17,56.01 arc90 0,53.33
  pour Top: 0,5.81 75.22,5.81 arc90 75.52,6.11 75.52,53.71 arc90 73.22,56.01 2.43,56.01 arc90 0,53.51
INN  (via drill 0.35)
  Top 0.254: v14.5,42.71 15.01,42.2 D3.1 | U$3.1 19.71,37.3 16.8,40.21 v14.3,40.21 14.1,40.21 12.8,41.51 12.8,42.63 X1.5
  Bottom 0.254: v14.5,42.71 14.5,40.41 v14.3,40.21
INP  (via drill 0.35)
  Top 0.254: D2.1 15.13,37.71 v14.5,37.71 | U$3.2 19.21,36.8 16.6,39.41 v15.4,39.41 13.8,39.41 12.2,41.01 12.2,42.31 11.35,43.16 X1.9
  Bottom 0.254: v14.5,37.71 15.4,38.61 v15.4,39.41
INT2B  (via drill 0.35)
  Top 0.127: U$30.E2 25.05,18.56
  Top 0.2: 25.05,18.56 v25.5,19.01 | U7.30 52.7,23.71 54.1,22.31 v54.1,21.71
  Bottom 0.254: v25.5,19.01 25.7,19.21 27.7,19.21 29.61,21.12 36.19,21.12 38.8,18.51 51.8,18.51 54.1,20.81 v54.1,21.71
INTB  (via drill 0.35)
  Top 0.127: U$30.D2 25.3,17.26 26.3,17.26 26.82,17.78 v27.54,17.78
  Top 0.2: U7.31 52.8,24.11 v55.2,21.71
  Bottom 0.2: 52.1,18.01 27.77,18.01 v27.54,17.78
  Bottom 0.254: v55.2,21.71 54.8,21.31 54.8,20.71 52.1,18.01
LED1  (via drill 0.35)
  Top 0.2: v50.8,23.91 50.8,24.71 51.4,25.31 U7.34 | v38.6,48.11 37.9,48.81 17.71,48.81 16.4,50.12 v16.2,50.12
  Bottom 0.2: v50.8,23.91 50.5,23.61 50.5,22.61 49.7,21.81 44.6,21.81 43.8,21.01 42.7,21.01 39.9,23.81 39.9,46.91 38.8,48.01 38.6,48.01 v38.6,48.11
  Bottom 0.254: R51.2 9.15,47.91 12.9,47.91 15.12,50.12 v16.2,50.12
LED2  (via drill 0.35)
  Top 0.2: U7.32 53.4,24.51 v54.2,23.71
  Bottom 0.2: v54.2,23.71 56.2,23.71 57.5,22.41 57.5,21.61 52.2,16.31 42.3,16.31 41.1,17.51 30.3,17.51 29.8,17.01 24,17.01 23.6,17.41 18,17.41 16.8,18.61 16.8,24.51 10.2,31.11 6.8,31.11 2.7,35.21 R49.1
LED_DRV_SUP  (via drill 0.35)
  Top 0.254: U$3.17 25.14,29.53 25.16,29.51 25.16,29.18 25.36,28.97 25.66,29.27 | 25.66,29.27 C10.1 24.18,28.01 15.43,28.01 D5.3 14.79,28.42 v16,27.21 | D1.3 14.79,34.32 v13.8,35.31 | U$3.18 25.64,31.07 25.9,30.81 v26,30.81 26,29.61 25.66,29.27
  Top 0.406: v37,45.21 38.2,45.21 39.07,46.07 41,46.07 41,46.67 U$11.2 41.07,47 C28.1
  Bottom 0.254: v16,27.21 16,33.11 v13.8,35.31
  Bottom 0.406: v26,30.81 26.4,31.21 26.4,39.21 32.4,45.21 v37,45.21
MISO  (via drill 0.35)
  Top 0.2: U$30.E3 24.55,19.96 v24.4,20.11 | U7.6 36.3,26.51 v32.1,30.71
  Top 0.254: U$3.25 28.11,34.8 32.1,30.81 v32.1,30.71
  Bottom 0.254: v24.4,20.11 23.7,20.11 22.7,19.11 22,19.11 21.6,19.51 21.6,20.91 31.4,30.71 v32.1,30.71
MOSI  (via drill 0.35)
  Top 0.2: U$30.E4 24.05,18.86 v23.8,19.11 | U7.5 37.2,26.91 v31.5,32.61
  Top 0.254: U$3.26 28.71,35.3 31.4,32.61 v31.5,32.61
  Bottom 0.254: v23.8,19.11 23.3,18.61 21.8,18.61 21,19.41 21,21.11 31.4,31.51 31.4,32.51 v31.5,32.61
N$1
  Top 0.254: S2.1 69,42.81 R1.2
N$2
  Bottom 0.254: LED1.4 3.21,38.7 4.2,37.71 R48.2
N$3  (via drill 0.35)
  Top 0.2: JP_SW3.3 29.26,47.37 30,48.11 34.9,48.11 35,48.01 v35.1,48.11
  Bottom 0.2: K1.16 35.4,52.51 35.4,48.41 v35.1,48.11
N$4
  Top 0.2: U7.2 41.9,28.11 40.3,29.71 R3.1
N$5
  Top 0.2: U7.3 41.6,27.71 40.7,28.61 R6.1
N$6
  Top 0.2: U7.24 49.4,21.71 52.1,19.01 R9.2
N$7
  Top 0.254: J5.B5 67.55,12.56 66.8,13.31 R15.1
N$8
  Top 0.406: U$26.1 52.45,41.76 52.55,41.86 | 52.55,41.86 52.7,42.01 52.7,44.37 U3.1 53.25,45.46 C37.2 55.28,45.59 55.8,46.11 61.2,46.11 D10.C 63.5,48.21 65.2,46.51 68.4,46.51 69.2,47.31 71.3,47.31 S2.3 | C22.1 53.5,41.86 | 53.5,41.86 52.55,41.86 | Q3.2 55.75,41.41 53.95,41.41 53.5,41.86
N$9
  Top 0.254: U$3.38 23.14,39.25 C6.2 22.44,43.21 U$4.2
N$10
  Top 0.254: J5.A5 67.55,9.56 R16.1
N$11
  Top 0.2: U4.6 59.7,11.31 59.9,11.11 63.5,11.11 64.7,9.91 SWIO3.TP
N$12
  Top 0.254: J5.A6 70.15,10.56 70.4,10.81 70.4,11.31 70.15,11.56 J5.B6 66.15,11.56 65.7,12.01 65.7,13.81 R8.1
N$13
  Top 0.254: U$3.37 23.64,39.75 C7.2 23.84,41.49 U$4.1
N$14
  Top 0.2: U7.21 R18.2
N$15
  Top 0.254: U$3.7 19.79,34.3 C8.1
N$16
  Top 0.254: U$3.30 27.71,37.6 TP4.P$1
N$17
  Top 0.152: 66.15,10.06 R10.1
  Top 0.254: 68.95,10.06 J5.B7 67.85,10.06 | J5.A7 69.1,10.96 67.5,10.96 67.5,10.41 67.85,10.06 | 67.85,10.06 66.15,10.06
N$18
  Top 0.254: U5.5 49.12,37.67 R11.2
N$19
  Top 0.2: U7.20 47.8,21.31 46.8,20.31 46.1,20.31 45.49,19.7 Y2.P3 45.34,19.31 C36.2
N$20
  Top 0.2: Y2.P1 47.09,17.96 48.2,17.96 R18.1 48.2,17.91 C31.2
N$21
  Top 0.254: J3.B5 67.75,24.06 66.9,24.91 R26.1
N$23  (via drill 0.35)
  Top 0.254: U4.18 53.5,15.81 54.4,14.91 v54.7,14.91 | SWIO4.TP 62.6,16.71 v62.4,16.51
  Bottom 0.254: v62.4,16.51 56.3,16.51 v54.7,14.91
N$25
  Top 0.254: U4.12 58.3,17.96 U$19.P$2 59.55,19.21 C15.2
N$26
  Top 0.254: 68.65,21.06 J3.A5 67.55,21.06 R27.1
N$27
  Top 0.254: U4.13 57.5,17.96 U$19.P$1 56.25,19.21 C1.1
N$28
  Top 0.2: U7.36 54.44,26.11 54.74,26.41 R37.1
N$29
  Top 0.2: U7.37 54.2,26.51 55,27.31 R36.1
N$30  (via drill 0.35)
  Top 0.254: v53.5,14.61 52.7,15.41 U4.19 | SWIO6.TP 63.1,18.61 v62.2,17.71
  Bottom 0.254: v62.2,17.71 56.2,17.71 53.5,15.01 v53.5,14.61
N$31
  Top 0.2: U4.22 50.3,17.01 SWIO2.TP
N$32
  Top 0.2: U7.25 49.8,21.81 51.6,20.01 R12.2
N$36
  Bottom 0.254: R49.2 1.8,37.46 LED1.2 0.92,37.11 LED1.1
N$46
  Bottom 0.254: LED1.6 2.7,40.16 R51.1
N$53
  Top 0.127: U$30.C6 21.99,17.01 21,18
  Top 0.254: 21,18 C29.1
N$55  (via drill 0.35)
  Top 0.076: U$30.B5 23.3,16.26 22.35,16.26 21.6,15.51
  Top 0.2: 21.6,15.51 v21.6,15.21 | v16.9,15.21 17.84,16.15 C26.2
  Bottom 0.2: v21.6,15.21 v16.9,15.21
N$56
  Top 0.127: U$30.D1 26.1,17.51 27.9,19.31 28,19.31
  Top 0.254: C32.1 27.21,22.04 28,21.25 28,19.31
N$57
  Top 0.127: U$30.B1 27.2,16.51 28.14,15.57 C34.1
N$59  (via drill 0.35)
  Top 0.406: R41.2 31.53,18.98 32.7,17.81 32.7,14.91 v31.6,13.81 | v6.2,9.61 6.2,10.86 JP3.SLEEVE
  Bottom 0.406: v31.6,13.81 31.3,13.51 9.9,13.51 6.2,9.81 v6.2,9.61
N$60
  Top 0.127: U$30.B6 20.65,16.51
  Top 0.254: 20.65,16.51 C26.1
N$61  (via drill 0.35)
  Top 0.127: U$30.A1 25.9,16.01 27.5,14.41 27.5,13.21 v28,12.71
  Top 0.254: v22.2,9.91 22.1,9.91 21.76,10.25 21.14,10.25 C63.2
  Bottom 0.254: v28,12.71 25,12.71 v22.2,9.91
N$62
  Top 0.254: U$30.A2 25.05,13.76 C66.2
N$63
  Top 0.254: U$30.A3 24.55,14.06 24.2,13.71 C69.1 24.2,11.81 C67.1 25.05,12.16 R42.2
N$64
  Top 0.254: U$30.A4 24.05,14.76 22.9,13.61 C69.2 23.3,12.96 C68.1 22.7,10.86 21.75,10.86 21.05,11.56 R43.2
N$65
  Top 0.127: U$30.B2 25.3,16.26 26.35,16.26 28.28,14.33 R44.1
QSPI-0
  Top 0.2: U7.53 47,30.73 U6.5
QSPI-1
  Top 0.2: U7.55 46.2,29.81 45.8,30.21 41.7,30.21 40.7,31.21 40.7,33.41 41.23,33.94 U6.2
QSPI-2
  Top 0.2: U7.54 46.6,30.01 46,30.61 41.8,30.61 41.3,31.11 41.3,32.01 41.97,32.67 U6.3
QSPI-3
  Top 0.2: U7.51 47.8,29.91 48.22,30.33 48.26,30.33 48.78,30.85 48.78,33.23 48.06,33.94 U6.7
QSPI-CLK
  Top 0.2: U7.52 47.4,30.41 47.7,30.71 48.1,30.71 48.4,31.01 48.4,31.95 U6.6
QSPI-CS  (via drill 0.35)
  Top 0.2: U7.56 45.4,29.74 41.46,29.74 40.2,31.01 40.2,33.81
  Top 0.254: 40.2,33.81 40.2,34.11 | 40.2,34.11 40.2,34.21 40.8,34.81 R22.1 40.99,35.21 U6.1 | 40.2,34.11 40.1,34.21 36.3,34.21 34.9,32.81 v34.6,32.81 | v40.5,19.62 41.4,19.62 43.4,17.62 43.4,16.81 R21.1
  Bottom 0.254: v34.6,32.81 34.6,31.71 38,28.31 38,22.12 v40.5,19.62
RP_D+
  Top 0.254: R20.1 64.8,28.71 65.3,28.21 65.3,24.71 66.95,23.06 J3.B6 70.15,23.06 70.4,22.81 70.4,22.31 70.15,22.06 J3.A6
RP_D-
  Top 0.254: J3.A7 67.3,22.56 | 67.3,22.56 66.25,22.56 64,24.81 R19.1 | J3.B7 67.45,21.56 67.3,21.71 67.3,22.56
RX_ANA_SUP  (via drill 0.35)
  Top 0.254: v21.4,38.71 21.7,39.01 22.4,39.01 22.64,38.77 U$3.39 22.64,37.17 22.8,37.01 25.4,37.01 25.64,37.25 U$3.33 25.64,38.95 26.31,39.62 C11.1 | v17.3,35.41 17.11,35.6 D2.3 | D3.3 v14.11,44 v14.1,44.01
  Top 0.406: U$7.2 32.95,38.17 C18.1 31.89,38.32 30.59,39.62 C11.1
  Bottom 0.254: v17.3,35.41 18.1,35.41 v21.4,38.71 20.9,38.71 15.6,44.01 v14.1,44.01
RX_DIG_SUP
  Top 0.254: U$3.31 27.17,38.61 29.85,38.61 32.26,36.2 R47.1
  Top 0.406: C19.1 43.63,38.17 U$9.2 39.7,38.17 37.33,35.81 34.5,35.81 34.22,36.08 C12.1 33.74,36.2 R47.1
SCK  (via drill 0.35)
  Top 0.2: U$30.E5 23.55,18.26 22.4,19.41 v22.4,19.91 | U7.4 37.9,27.31 v35.5,29.71
  Top 0.254: U$3.24 27.91,34.3 30.5,31.71 30.5,30.51 v31.4,29.61
  Bottom 0.2: v35.5,29.71 31.5,29.71 v31.4,29.61
  Bottom 0.254: v22.4,19.91 22.4,20.61 v31.4,29.61
SD_CS  (via drill 0.35)
  Top 0.2: U7.16 46.2,21.91 46,21.71 45.6,21.71 45.4,21.91 43,21.91 v42.9,21.81
  Top 0.254: v42.9,21.81 40.9,21.81 39.7,20.61 39.7,17.91 40.4,17.21 v40.4,16.41
  Bottom 0.2: v40.4,16.41 31.2,16.41 30.9,16.11 23.2,16.11 22.6,16.71 17.3,16.71
  Bottom 0.254: J4.2 6.44,15.15 7.8,16.51 7.8,18.16 10,20.36 13.55,20.36 13.6,20.31 | 17.3,16.71 17.2,16.71 13.6,20.31 | R5.1 15.35,22.06 13.6,20.31
SPO2_CS  (via drill 0.35)
  Top 0.2: U7.39 53.6,27.31 56.4,30.11 56.4,33.41 57.3,34.31 57.3,35.41 57,35.71 49.2,35.71 v49.1,35.61 | v43.8,29.01 41.6,29.01 37.8,32.81 36.5,32.81 35.4,31.71 33.6,31.71 31.12,34.19
  Top 0.254: U$3.27 29.51,35.8 31.12,34.19
  Bottom 0.2: v49.1,35.61 49.1,32.61 45.5,29.01 v43.8,29.01
SPO2_DRDY  (via drill 0.35)
  Top 0.2: U7.28 51.14,22.61 v51.9,22.61
  Top 0.254: U$3.28 30.11,36.3 v30.7,35.71
  Bottom 0.2: v51.9,22.61 52.4,22.11 52.4,21.21 50.6,19.41 41.7,19.41 38.5,22.61 38.5,24.81 | v30.7,35.71 32.9,35.71
  Bottom 0.254: 32.9,35.71 34.9,35.71 35.5,35.11 35.5,31.61 38.5,28.61 38.5,24.81
SPO2_START  (via drill 0.35)
  Top 0.2: U7.29 52.5,23.31 53.1,22.71 v53.1,22.21
  Top 0.254: v31.8,26.41 31.8,27.11 26.88,32.03 U$3.20
  Bottom 0.254: v53.1,22.21 53,22.11 53,20.61 51.3,18.91 39.3,18.91 v31.8,26.41
SW1  (via drill 0.35)
  Top 0.254: U7.15 43.74,22.47 v43.6,22.61
  Bottom 0.254: v43.6,22.61 43.6,28.01 41.6,30.01 41.6,47.11 43,48.51 43,51.81 43.7,52.51 48.1,52.51 K1.26
SW2  (via drill 0.35)
  Top 0.2: U7.17 46.6,21.81 45.9,21.11 v44.9,21.11
  Top 0.254: K1.31 58.32,49.91 65.7,49.91 v65.8,49.81
  Bottom 0.254: v65.8,49.81 69.8,49.81 71.4,48.21 71.4,31.51 68.4,28.51 65.7,28.51 61.7,24.51 52.5,24.51 51,23.01 51,22.11 50,21.11 v44.9,21.11
SW3  (via drill 0.35)
  Top 0.2: JP_SW3.2 30.3,44.71 31.7,43.31 v31.8,43.31 | v41.58,20.49 41.66,20.41 45.6,20.41 45.9,20.71 46.2,20.71 47,21.51 U7.18
  Bottom 0.2: v31.8,43.31 34,43.31 36.3,41.01 36.3,31.41 39,28.71 39,23.11 41.58,20.53 v41.58,20.49
SWDCK  (via drill 0.35)
  Top 0.2: v61.3,21.11 60.9,20.71 57.5,20.71 56.8,20.01 54.7,20.01 53.7,19.01 R9.1
  Bottom 0.2: v61.3,21.11 63.8,23.61 70,23.61 J6.1
SWDIO  (via drill 0.35)
  Top 0.2: v66.4,21.61 66.2,21.81 60.06,21.81 59.38,21.13 57.32,21.13 56.6,20.41 53.9,20.41 R12.1
  Bottom 0.2: v66.4,21.61 66.7,21.31 J6.3
TFT_BKL  (via drill 0.35)
  Top 0.2: U7.27 50.6,22.01 51.1,21.51 v51.6,21.51
  Bottom 0.2: v51.6,21.51 49.9,19.81 43.3,19.81 39.4,23.71 39.4,46.31 38.5,47.21 34.7,47.21 32.9,49.01 32.9,52.46 K1.12
TFT_CS  (via drill 0.35)
  Top 0.2: U7.41 53.1,28.11 55.3,30.31 55.3,33.51 v55.1,33.71 | v45.4,43.51 45.9,44.01 45.9,48.61 48.1,50.81 48.1,52.5 K1.24
  Bottom 0.2: v55.1,33.71 54.6,33.71 45.4,42.91 v45.4,43.51
TFT_DC  (via drill 0.35)
  Top 0.2: U7.35 51,25.71 50.6,26.11 v50.6,26.61 | v44.2,43.51 44.2,43.71 45.4,44.91 45.4,52.56 44.29,53.68 K1.22
  Bottom 0.2: v50.6,26.61 60.9,26.61 65.7,31.41 65.7,32.51 65.3,32.91 54.7,32.91 44.2,43.41 v44.2,43.51
TFT_RESET  (via drill 0.35)
  Top 0.2: U7.40 53.3,27.71 55.9,30.31 55.9,33.61 56.6,34.31 v56.6,35.01 | 60.1,37.71 58.5,36.11 v58.5,35.01
  Top 0.254: 60.1,37.71 61.55,37.71 65.2,41.36 v65.2,42.81
  Bottom 0.2: v58.5,35.01 v56.6,35.01
  Bottom 0.254: v65.2,42.81 69.2,42.81 70.3,43.91 70.3,46.01 68.1,48.21 65.5,48.21 63.3,50.41 63.3,52.54 K1.36
TMP_SCL  (via drill 0.35, 0.35 pad 0.65)
  Top 0.2: U7.9 37.6,25.31 35.1,22.81 v35.1,13.81 | 9.07,5.53 8.8,5.81 J1.4 | U1.7 15.75,7.36 14.6,6.21
  Top 0.254: v26,7.61 24.82,7.61 R7.2 | v24.2,46.31 24.2,44.51 v24.5,44.21 | v18,25.71 18,24.51 14.3,20.81 9.7,20.81 8.9,20.01 8.9,5.71 9.07,5.53 | 9.07,5.53 v9.1,5.51 | 9.07,5.53 10.3,6.76 11.05,6.76 | U$38.6 11.5,7.21 11.05,6.76 | 14.6,6.21 11.6,6.21 11.05,6.76
  Bottom 0.254: v35.1,13.81 34.8,13.51 34.8,8.91 33.7,7.81 26.2,7.81 v26,7.61 23.8,7.61 22,5.81 9.4,5.81 v9.1,5.51 | K1.5 23.97,46.44 24.1,46.31 v24.2,46.31 | v24.5,44.21 24.5,39.51 18,33.01 v18,25.71
TMP_SDA  (via drill 0.35)
  Top 0.2: U7.8 37.2,25.71 34,22.51 v34,13.81 | v7.5,6.91 5.12,6.91 J1.3
  Top 0.254: R33.2 22.72,7.62 v22.6,7.51 | v22.7,46.31 23.1,45.91 v23.1,44.21 | v16.9,26.31 16.9,24.81 13.4,21.31 9.3,21.31 8.3,20.31 8.3,7.71 v7.5,6.91 | U$38.5 10.6,9.17 v10.6,7.61 | v16.6,7.11 16.6,7.71 U1.8
  Bottom 0.2: v34,13.81 34,8.71 33.8,8.51
  Bottom 0.254: v22.6,7.51 23.6,8.51 33.8,8.51 | v7.5,6.91 8.2,7.61 v10.6,7.61 10.8,7.61 11.7,8.51 13.6,8.51 14.3,7.81 15.9,7.81 v16.6,7.11 17.4,7.91 22.2,7.91 v22.6,7.51 | v22.6,7.51 22.5,7.61 | K1.3 22.6,50.06 22.6,46.41 v22.7,46.31 | v23.1,44.21 23.1,39.21 16.9,33.01 v16.9,26.31
TX_CTRL_SUP  (via drill 0.35)
  Top 0.254: 19.81,32.03 C9.1 | U$3.11 22.12,32.01 21,32.01
  Top 0.305: 21,32.01 v20.7,32.01 19.8,32.01 C9.1 | v31.3,45.31 31.46,45.47 C27.1 34.13,45.47 35.44,46.77 U$10.2
  Bottom 0.305: v20.7,32.01 20.7,34.81 31.2,45.31 v31.3,45.31
TXN
  Top 0.254: U$3.14 23.64,31.35 22.9,30.61 17.6,30.61 15.76,32.45 D1.1 15.18,32.71 14.8,32.71 13,34.51 13,37.11 11.1,39.01 X1.3
TXP
  Top 0.254: U$3.15 24.14,31.05 23.1,30.01 14.58,30.01 D5.1 14.14,31.17 12.4,32.91 12.4,35.71 11.87,36.24 X1.2
U0RXD  (via drill 0.35)
  Top 0.2: JP_SW3.1 32.39,46.91 v32.6,46.7 | R6.2 36.8,30.41 36.8,31.91 v37,32.11
  Bottom 0.2: v37,32.11 37,41.51 38.4,42.91 38.4,45.61 37.6,46.41 32.89,46.41 v32.6,46.7 29.19,50.11 28.6,50.11 27.9,50.81 | K1.8 27.11,53.78 27.9,52.98 27.9,50.81 | J7.1 16.3,47.11 18.2,45.21 25.7,45.21 27.9,47.41 27.9,50.81
U0TXD  (via drill 0.35)
  Top 0.2: v25.3,52.51 27.78,52.51 K1.10 | R3.2 37.7,30.61 v37.7,31.21
  Bottom 0.2: v37.7,31.21 37.7,41.31 38.9,42.51 38.9,45.91 38,46.81 33.9,46.81 31.8,48.91 | v25.3,52.51 25.3,50.61 27.05,48.86 27.05,47.49 25.18,45.63 18.56,45.63 16.41,47.78 14.36,47.78 13.7,47.12 13.7,45.61 14.2,45.11 J7.3
  Bottom 0.254: K1.10 30.3,52.52 30.3,50.41 31.8,48.91
USB_D+  (via drill 0.35)
  Top 0.254: v48.9,13.21 48.4,13.71 U4.27 | R8.2 63.4,15.01 v61.2,15.01
  Bottom 0.254: v48.9,13.21 58.6,13.21 60.4,15.01 v61.2,15.01
USB_D-  (via drill 0.35)
  Top 0.254: U4.26 46.3,14.51 45.9,14.11 v45.9,14.01 | v62,14.21 63.5,14.21 64.8,12.91 R10.2
  Bottom 0.254: v45.9,14.01 46.5,14.01 48.3,12.21 58.6,12.21 60.6,14.21 v62,14.21
USB_F_N  (via drill 0.35)
  Top 0.2: U7.46 49.8,28.71 v50.7,27.81 | R19.2 62.3,28.11 v60.7,28.11
  Bottom 0.2: v60.7,28.11 51,28.11 v50.7,27.81
USB_F_P  (via drill 0.35)
  Top 0.2: U7.47 49.4,28.31 v49.3,28.21 | v62.4,30.11 62.4,29.31 R20.2
  Bottom 0.2: v49.3,28.21 49.8,28.71 51.6,28.71 53,30.11 v62.4,30.11
VBAT  (via drill 0.35)
  Top 0.254: 15.35,11.46 15.35,11.21 15.75,10.81 U1.2 | 15.35,11.46 C5.1 16.4,10.81 16.6,10.81 16.8,10.61 16.8,8.11 18.6,6.31 26.5,6.31 v27.1,6.91 | JP6.2 65.2,34.01 66.5,32.71 66.5,31.11 68.8,28.81 70.7,28.81 72.3,27.21 72.3,18.31 70.7,16.71 v69.2,16.71 | 15.35,11.46 15.25,11.36 U1.3
  Top 0.406: U5.3 53.88,39.86 54.18,39.56 | 54.18,39.56 C65.1 | R13.2 55.73,39.56 54.18,39.56 | Q3.3 58.2,41.01 57.12,39.92 R13.2 | JP6.2 63.9,34.01 62.9,35.01 v61.2,35.01 | v58.7,38.01 56.78,39.92 R13.2
  Bottom 0.254: v69.2,16.71 68.3,15.81 68.3,10.41 65.4,7.51 61.2,7.51 59.3,9.41 45.3,9.41 44.7,10.01 37.2,10.01 34,6.81 27.2,6.81 v27.1,6.91
  Bottom 0.406: v61.2,35.01 60.7,35.01 58.7,37.01 v58.7,38.01
VBUS  (via drill 0.35)
  Top 0.254: J3.VBUS2 69,24.86 | TP5.TP 67,27.21 67.8,26.41 67.8,25.21 68.25,24.76 J3.VBUS2 | J5.VBUS1 69.9,8.36 71.3,9.76 71.3,11.86 69.9,13.26 J5.VBUS2 68.45,13.26 67.9,13.81 67.9,19.51 68.25,19.86 J3.VBUS1 69.85,19.86 71.3,21.31 71.3,23.31 69.85,24.76 J3.VBUS2
  Top 0.406: D9.A v69.3,48.21 | v65.7,29.41 65.9,29.41 TP5.TP
  Bottom 0.406: v69.3,48.21 70,48.21 70.8,47.41 70.8,32.01 68.2,29.41 v65.7,29.41
VCM
  Top 0.254: U$3.4 20.81,35.8 20.4,36.21 18.8,36.21 16.4,38.61 13.4,38.61 11.6,40.41 10,40.41 8.5,41.91 7.2,41.91 6.6,42.51 6.6,44.11 8.6,46.11 11.8,46.11 13.3,44.61 13.3,42.81 15.4,40.71 17.2,40.71 | 21.5,37.81 21,37.81 20.99,37.8 20.11,37.8 17.2,40.71 | C13.1 17.46,40.96 17.2,40.71
VDD  (via drill 0.35)
  Top 0.2: C64.1 46.63,39.47 45.8,40.31 43.6,40.31 42.7,39.41 34.2,39.41 33.9,39.71 33.9,41.01 33.4,41.51 30.2,41.51 24.7,47.01 21,47.01 v20.9,46.91
  Top 0.254: SWIO7.TP 66.4,42.51 D9.C
  Top 0.406: D9.C D10.A 63.1,44.41 60.4,44.41 D8.C 58.1,44.61 R4.2 57.5,45.06 Q3.1 | Q3.1 56.4,43.76 57.1,43.06 57.1,41.21 56.6,40.71 49.97,40.71 U5.4 48.73,39.47 C64.1 | R30.2 55.55,43.76 Q3.1
  Bottom 0.2: LED1.5 3.88,39.49 5,40.61 5,42.01 10.4,47.41 13.2,47.41 15.2,49.41 20.2,49.41 20.9,48.71 v20.9,46.91

## Text on the board
tPlace: 2 | 40 | protocentral.com | ON | 39 | SW3 | 1.8V | OFF | POWER | 3.7v / Li-Ion | RP2040 USB | ECG | IO8 | IO5 | IO4 | RP2040 / BOOTSEL | RP2040 / RESET | ESP / RESET | ESP / BOOT | ESP32 USB | IO3 | v5.3 | 05/23
bPlace: 05/23 | RX | TX | RP2040 / UART | LED | RP_BOOT | RP2040 / DEBUG | SD_CARD | SWCLK | SWDIO | WARNING: / When connected / to body,power / only through an / isolated source / or battery | v5.3 | Get Started: healthypi.protocentral.com | protocentral.com